# EAGLE design CarteMere_V1 (EAGLE 8.4.0)
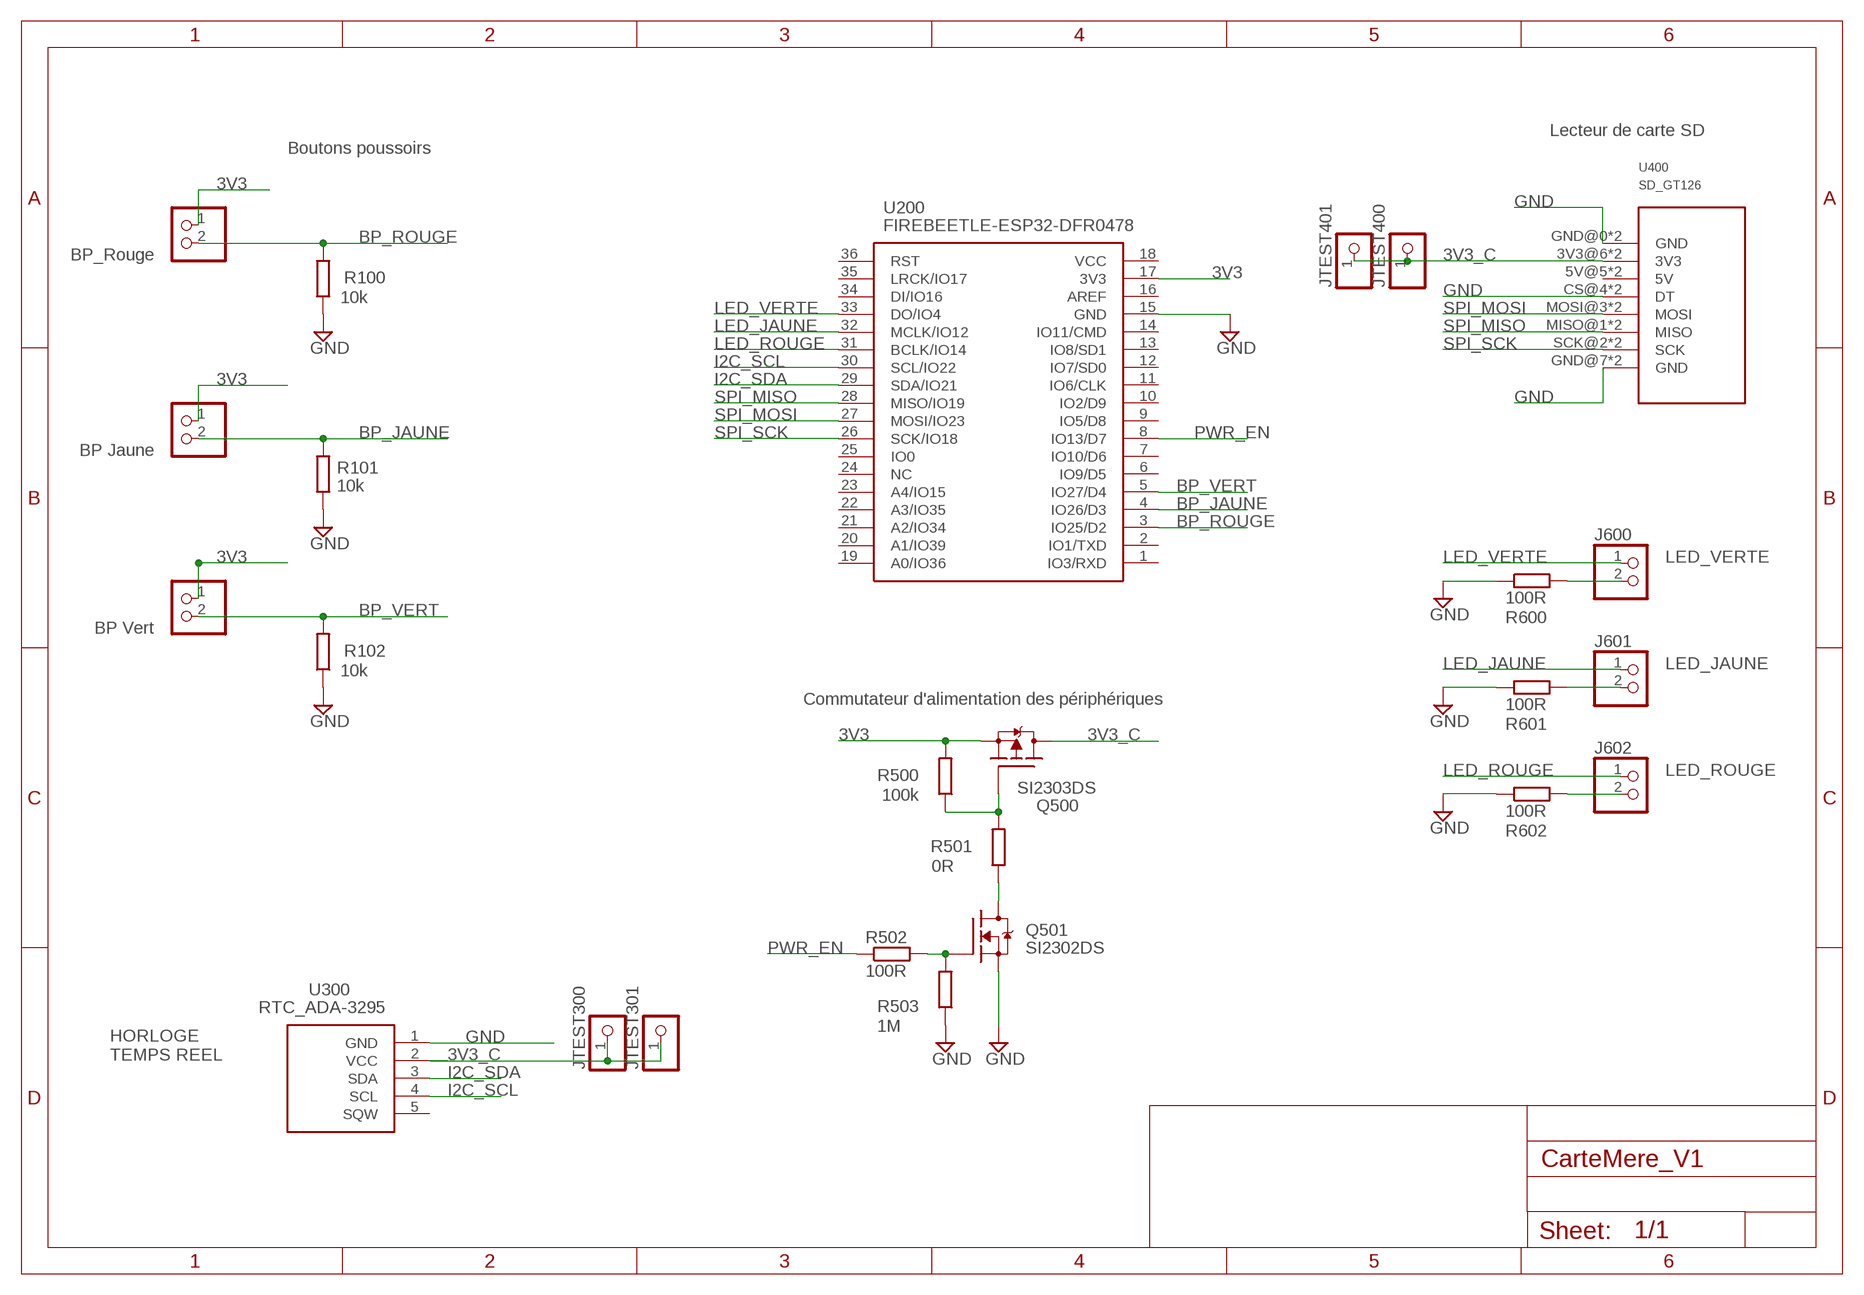
[diagram p0: schematic, sheet 1]
FRAME1 (A4L-LOC): SPICEPREFIX: X

## Parts
J100  BP_Rouge  PINHD-1X2  [1X02]
J101  BP Jaune  PINHD-1X2  [1X02]
J102  BP Vert  PINHD-1X2  [1X02]
J600  LED_VERTE  PINHD-1X2  [1X02]
J601  LED_JAUNE  PINHD-1X2  [1X02]
J602  LED_ROUGE  PINHD-1X2  [1X02]
JTEST300  PINHD-1X1  [1X01]
JTEST301  PINHD-1X1  [1X01]
JTEST400  PINHD-1X1  [1X01]
JTEST401  PINHD-1X1  [1X01]
Q500  SI2303DS  [SOT23]
Q501  SI2302DS  [SOT23]
R100  10k  R_1/4W10  [0207/10]
R101  10k  R_1/4W10  [0207/10]
R102  10k  R_1/4W10  [0207/10]
R500  100k  R_1/4W10  [0207/10]
R501  0R  R_1/4W10  [0207/10]
R502  100R  R_1/4W10  [0207/10]
R503  1M  R_1/4W10  [0207/10]
R600  100R  R_1/4W10  [0207/10]
R601  100R  R_1/4W10  [0207/10]
R602  100R  R_1/4W10  [0207/10]
U200  FIREBEETLE-ESP32-DFR0478  [FIREBEETLE_ESP32]
U300  RTC_ADA-3295  [ADA3295]
U400  SD_GT126  [SD_GT126]

## Nets
3V3: J100.1 J101.1 J102.1 Q500.2(S) R500.2 U200.17(3V3)
3V3_C: JTEST300.1 JTEST301.1 JTEST400.1 JTEST401.1 Q500.3(D) U300.2(VCC) U400.3V3@6(3V3) U400.3V3@9(3V3)
BP_JAUNE: J101.2 R101.2 U200.4(IO26/D3)
BP_ROUGE: J100.2 R100.2 U200.3(IO25/D2)
BP_VERT: J102.2 R102.2 U200.5(IO27/D4)
DQ501: Q501.3(D) R501.1
GND: Q501.2(S) R100.1 R101.1 R102.1 R503.1 R600.1 R601.1 R602.1 U200.15(GND) U300.1(GND) U400.CS@4(DT) U400.CS@11(DT) U400.GND@0(GND) U400.GND@7(GND) U400.GND@8(GND) U400.GND@15(GND)
I2C_SCL: U200.30(SCL/IO22) U300.4(SCL)
I2C_SDA: U200.29(SDA/IO21) U300.3(SDA)
LED_JAUNE: J601.1 U200.32(MCLK/IO12)
LED_ROUGE: J602.1 U200.31(BCLK/IO14)
LED_VERTE: J600.1 U200.33(DO/IO4)
N$1: Q501.1(G) R502.2 R503.2
N$2: J600.2 R600.2
N$3: J601.2 R601.2
N$4: J602.2 R602.2
N$7: Q500.1(G) R500.1 R501.2
PWR_EN: R502.1 U200.8(IO13/D7)
SPI_MISO: U200.28(MISO/IO19) U400.MISO@1(MISO) U400.MISO@14(MISO)
SPI_MOSI: U200.27(MOSI/IO23) U400.MOSI@3(MOSI) U400.MOSI@12(MOSI)
SPI_SCK: U200.26(SCK/IO18) U400.SCK@2(SCK) U400.SCK@13(SCK)
Unconnected: U200.1(IO3/RXD) U200.2(IO1/TXD) U200.6(IO9/D5) U200.7(IO10/D6) U200.9(IO5/D8) U200.10(IO2/D9) U200.11(IO6/CLK) U200.12(IO7/SD0) U200.13(IO8/SD1) U200.14(IO11/CMD) U200.16(AREF) U200.18(VCC) U200.19(A0/IO36) U200.20(A1/IO39) U200.21(A2/IO34) U200.22(A3/IO35) U200.23(A4/IO15) U200.24(NC) U200.25(IO0) U200.34(DI/IO16) U200.35(LRCK/IO17) U200.36(RST) U300.5(SQW) U400.5V@5(5V) U400.5V@10(5V)

## Notes on the sheet
- Lecteur de carte SD
- Boutons poussoirs
- Commutateur d'alimentation des périphériques
- HORLOGE
  TEMPS REEL

## Library data of the parts
J100-J102 J600-J602 = pinhead:PINHD-1X2: PIN HEADER
JTEST300 JTEST301 JTEST400 JTEST401 = pinhead:PINHD-1X1: PIN HEADER
Q500 = Eagle_UOF_Lib:SI2303DS: MOSFET Canal P
Q501 = Eagle_UOF_Lib:SI2302DS
R100-R102 R500-R503 R600-R602 = Eagle_UOF_Lib:R_1/4W
U200 = Eagle_UOF_Lib:FIREBEETLE-ESP32-DFR0478: Development Boards & Kits - Wireless FireBeetle ESP32 IOT MCU Source: Datasheet <https://github.com/Robert-MARKII/Document/blob/master/FireBeetle Board-ESP32 User Manual update.pdf>; DESCRIPTION: Development Boards & Kits - Wireless FireBeetle ESP32 IOT MCU; HEIGHT: mm; MANUFACTURER_NAME: DFRobot; MANUFACTURER_PART_NUMBER: DFR0478; MOUSER_PART_NUMBER: 426-DFR0478; MOUSER_PRICE-STOCK: https://www.mouser.co.uk/ProductDetail/DFRobot/DFR0478?qs=EU6FO9ffTwc%252BR65h2NUGQw%3D%3D
U300 = Eagle_UOF_Lib:RTC_ADA-3295: Real Time Clock module Source: Datasheet <https://learn.adafruit.com/adafruit-pcf8523-real-time-clock/downloads>; DESCRIPTION: Real Time Clock module; HEIGHT: 3.5mm; MANUFACTURER_NAME: Adafruit; MANUFACTURER_PART_NUMBER: ADA-3295
U400 = Eagle_UOF_Lib:SD_GT126

## Board
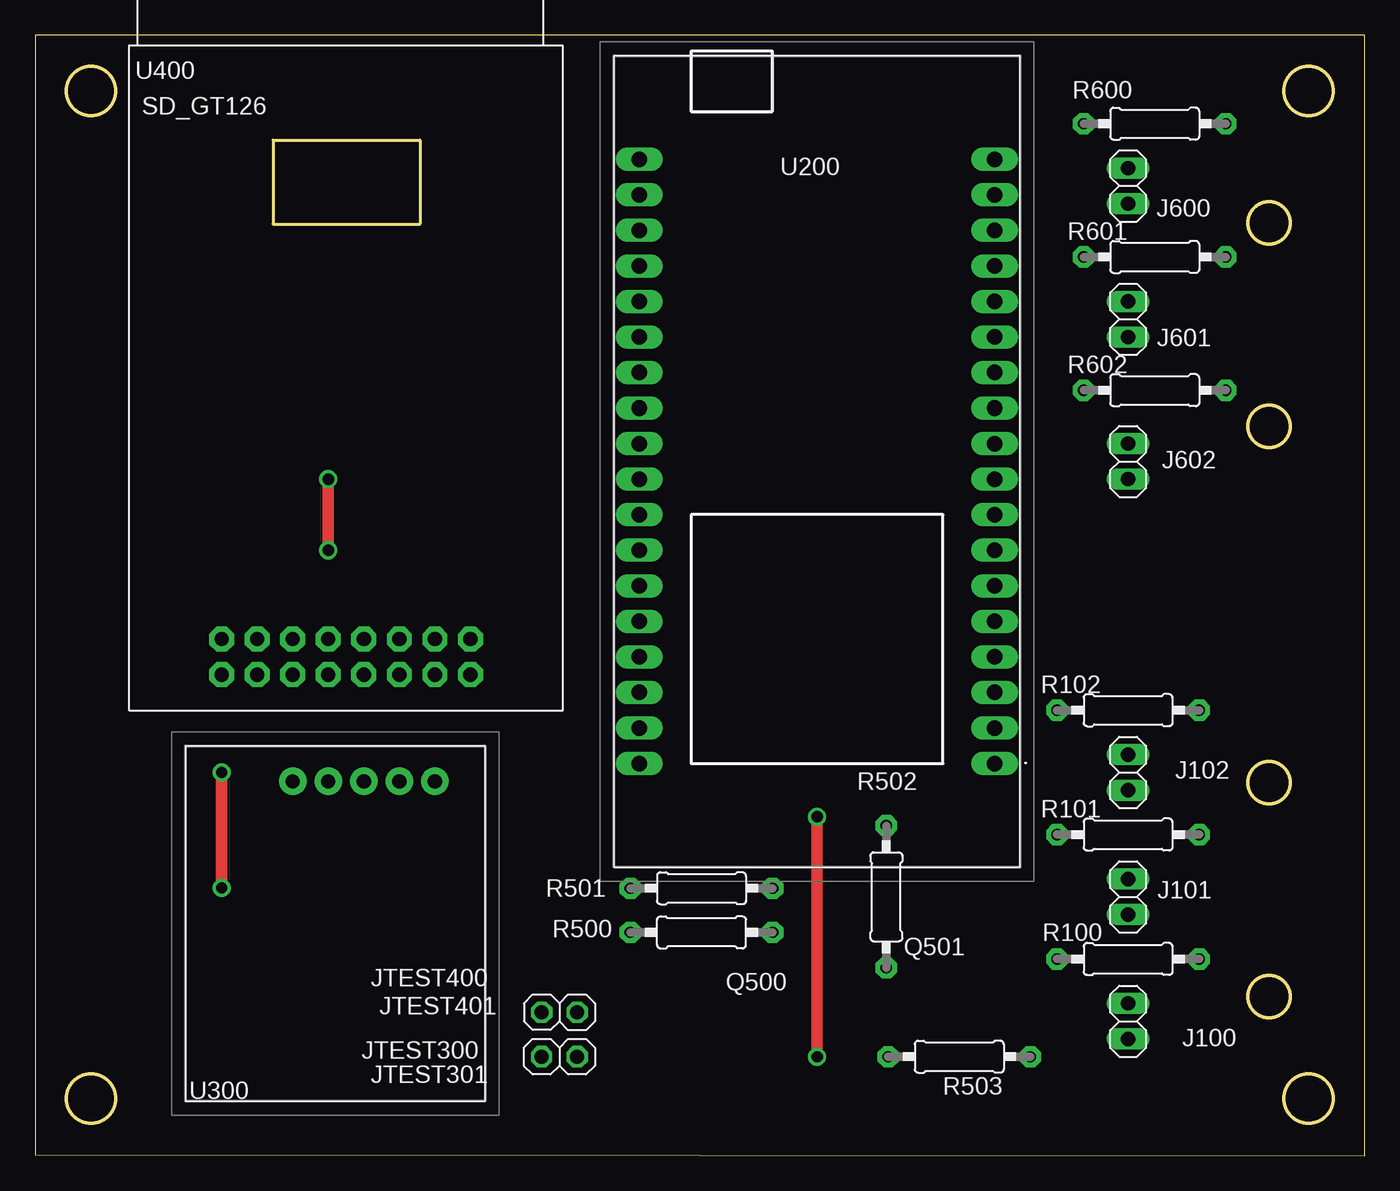
[diagram p1: board, top side]
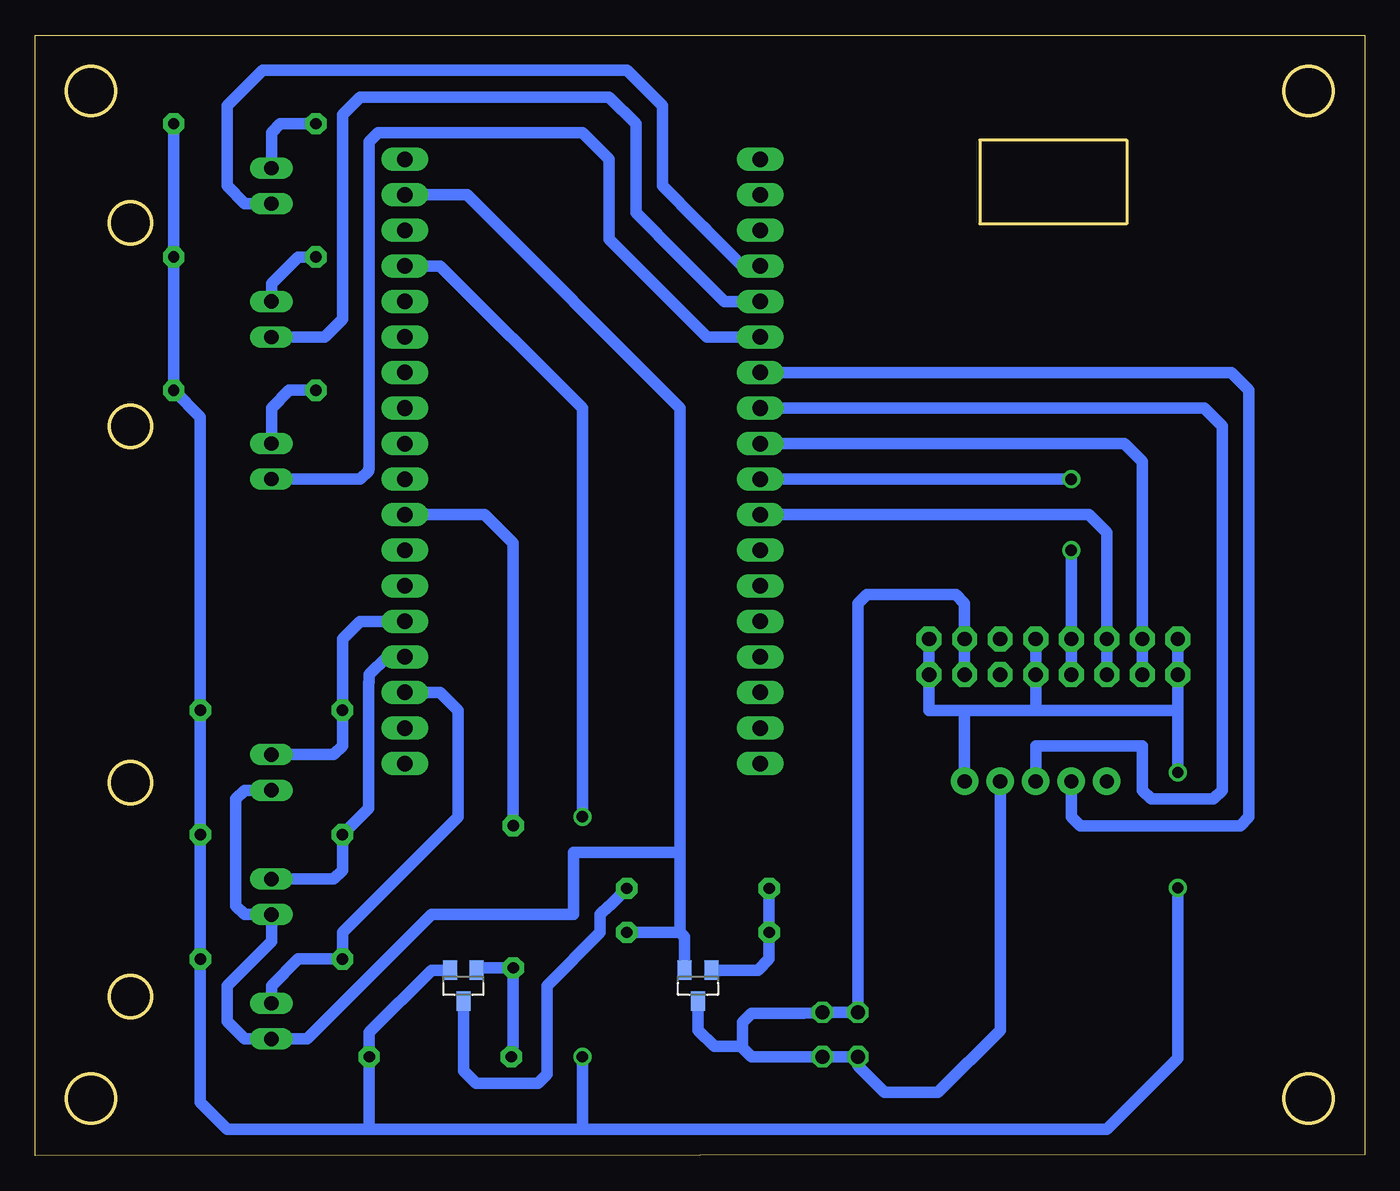
[diagram p2: board, bottom side, seen from below]

Size 95 x 80.08 mm. Coordinates in mm from the lower left corner, seen from the top.
Outline: 0,0.08 95,0 95,80.08 0,80.08 0,0.08
Outline: 17,72.58 27.5,72.58 27.5,66.58 17,66.58 17,72.58
Outline: circle at 4,76.08 radius 1.75
Outline: circle at 91,76.08 radius 1.75
Outline: circle at 91,4.08 radius 1.75
Outline: circle at 4,4.08 radius 1.75
Outline: circle at 88.19,66.65 radius 1.5
Outline: circle at 88.19,52.12 radius 1.5
Outline: circle at 88.19,26.65 radius 1.5
Outline: circle at 88.19,11.38 radius 1.5
Copper layers (1*16): Top 0.035mm / dielectric 1.5mm / Bottom 0.035mm
Design rules "default *": minimum track width 20mil, minimum drill 0.35mm, track to track 20mil, track to pad 20mil, pad to pad 20mil, via to via 20mil, smd to smd 6mil, copper to edge 20mil, drill to drill 20mil, minimum pad ring 10mil, minimum via ring 8mil, stop-mask expansion 4mil, vias tented up to drill 0mil, thermal gap 10mil

### Footprints (pad centres in the part's own frame; a part is rotated, then mirrored left to right if it is on the bottom)
1X02 = drill 1.016 long: 1 -1.27,0; 2 1.27,0
1X01 = drill 1.016 octagon: 1 0,0
SOT23 = smd 1 x 1.4: 1 -0.95,-1.1; 2 0.95,-1.1; 3 0,1.1
0207/10 = drill 0.813 pad 1.524 octagon: 1 -5.08,0; 2 5.08,0
FIREBEETLE_ESP32 = drill 1.11 pad 1.651 long: 1 25.4,12.7; 2 22.86,12.7; 18 -17.78,12.7 | drill 1.11 pad 1.665 long: 3 20.32,12.7; 4 17.78,12.7; 5 15.24,12.7; 6 12.7,12.7; 7 10.16,12.7; 8 7.62,12.7; 9 5.08,12.7; 10 2.54,12.7; 11 0,12.7; 12 -2.54,12.7; 13 -5.08,12.7; 14 -7.62,12.7; 15 -10.16,12.7; 16 -12.7,12.7; 17 -15.24,12.7; 19 25.4,-12.7; 20 22.86,-12.7; 21 20.32,-12.7; 22 17.78,-12.7; 23 15.24,-12.7; 24 12.7,-12.7; 25 10.16,-12.7; 26 7.62,-12.7; 27 5.08,-12.7; 28 2.54,-12.7; 29 0,-12.7; 30 -2.54,-12.7; 31 -5.08,-12.7; 32 -7.62,-12.7; 33 -10.16,-12.7; 34 -12.7,-12.7; 35 -15.24,-12.7; 36 -17.78,-12.7
ADA3295 = drill 1.016 pad 1.956: 1 0,0; 2 0,-2.54; 3 0,-5.08; 4 0,-7.62; 5 0,-10.16
SD_GT126 = drill 1.016 pad 1.778 octagon: 3V3@6 2.54,-6.35; 3V3@9 5.08,-6.35; 5V@5 2.54,-3.81; 5V@10 5.08,-3.81; CS@4 2.54,-1.27; CS@11 5.08,-1.27; GND@0 2.54,8.89; GND@7 2.54,-8.89; GND@8 5.08,-8.89; GND@15 5.08,8.89; MISO@1 2.54,6.35; MISO@14 5.08,6.35; MOSI@3 2.54,1.27; MOSI@12 5.08,1.27; SCK@2 2.54,3.81; SCK@13 5.08,3.81

### Placement (x,y rotation side)
J100  78.11,9.61 90 top
J101  78.11,18.49 90 top
J102  78.11,27.38 90 top
J600  78.11,69.3 90 top
J601  78.11,59.77 90 top
J602  78.11,49.61 90 top
JTEST300  36.2,7.07 0 top
JTEST301  38.74,7.07 0 top
JTEST400  36.2,10.25 0 top
JTEST401  38.74,10.24 0 top
Q500  47.62,12.14 180 bottom
Q501  64.39,12.14 180 bottom
R100  78.11,14.05 180 top
R101  78.11,22.94 180 top
R102  78.11,31.83 180 top
R500  47.62,15.96 0 top
R501  47.63,19.1 180 top
R502  60.83,18.49 270 top
R503  66.04,7.07 180 top
R600  80.01,73.74 180 top
R601  80.01,64.22 180 top
R602  80.01,54.69 180 top
U200  55.88,53.42 270 top
U300  28.57,26.75 270 top
U400  22.23,31.83 90 top

### Tracks (layer width: path | path; a pad name or v marks a point on that pad's centre or on a via)
3V3
  Bottom 0.813: 48.9,21.67 48.9,15.96 | 48.9,21.67 56.52,21.67 56.52,17.22 66.67,17.22 75.56,8.34 J100.1 80.01,8.34 81.28,9.61 81.28,12.14 78.11,15.32 J101.1 80.01,17.22 80.64,17.86 80.64,25.48 80.01,26.11 J102.1 | 48.9,21.67 48.9,53.42 64.14,68.66 U200.17 | 52.88,15.96 R500.2 48.9,15.96 | Q500.2 48.58,15.63 48.9,15.96
3V3_C
  Bottom 0.813: U400.3V3@6 U400.3V3@9 28.57,39.45 29.21,40.09 35.56,40.09 36.2,39.45 JTEST400.1 JTEST401.1 40.08,10.18 43.81,10.18 44.45,9.54 44.45,7.79 | Q500.3 47.62,8.97 46.45,7.79 44.45,7.79 | 44.45,7.79 44.45,7.7 43.81,7.07 JTEST301.1 JTEST300.1 36.2,6.43 34.29,4.53 30.48,4.53 26.04,8.97 U300.2
BP_JAUNE
  Bottom 0.813: J101.2 73.66,19.76 73.03,20.4 R101.2 71.16,24.81 71.16,33.82 71.12,33.86 71.12,34.37 69.85,35.64 U200.4
BP_ROUGE
  Bottom 0.813: J100.2 78.11,12.14 76.2,14.05 R100.2 73.03,15.96 64.77,24.21 64.77,31.83 66.04,33.1 U200.3
BP_VERT
  Bottom 0.813: J102.2 73.66,28.65 73.03,29.29 R102.2 73.03,36.91 71.75,38.18 U200.5
DQ501
  Bottom 0.813: Q501.3 64.39,6.05 63.5,5.16 59.05,5.16 58.42,5.79 58.42,12.14 54.61,15.96 54.61,17.22 53.98,17.86 53.95,17.83 R501.1
GND  (via drill 0.81 pad 1.3)
  Top 0.813: v13.34,27.38 v13.34,19.13 | v55.88,7.07 v55.88,24.21
  Bottom 0.813: U400.GND@15 U400.GND@0 13.34,31.83 | U400.GND@8 U400.GND@7 31.11,31.83 28.57,31.83 | U400.CS@11 U400.CS@4 23.5,31.83 | 28.57,31.83 23.5,31.83 | U300.1 28.57,31.83 | 13.34,31.83 23.5,31.83 | 13.34,31.83 v13.34,27.38 | 55.88,1.89 18.41,1.89 13.34,6.97 v13.34,19.13 | v55.88,7.07 55.88,1.89 | 71.12,1.89 55.88,1.89 | U200.15 66.04,63.58 55.88,53.42 v55.88,24.21 | 71.12,1.89 R503.1 71.12,8.8 66.67,13.24 Q501.2 | 71.12,1.89 81.28,1.89 83.19,3.79 R100.1 R101.1 R102.1 83.19,52.78 R602.1 R601.1 R600.1
I2C_SCL
  Bottom 0.813: U300.4 20.95,24.21 20.32,23.57 8.89,23.57 8.26,24.21 8.26,54.69 9.53,55.96 U200.30
I2C_SDA
  Bottom 0.813: U300.3 23.5,29.29 15.88,29.29 15.88,26.11 15.24,25.48 10.79,25.48 10.16,26.11 10.16,52.15 11.43,53.42 U200.29
LED_JAUNE
  Bottom 0.813: 48.9,64.22 48.26,63.58 | 48.9,64.22 52.07,67.39 52.07,73.74 53.98,75.64 71.75,75.64 73.03,74.38 73.03,59.77 74.3,58.5 J601.1 | U200.32 45.72,61.04 48.9,64.22
LED_ROUGE
  Bottom 0.813: J602.1 71.75,48.34 71.16,48.94 71.16,49.06 71.12,49.1 71.12,72.47 70.48,73.11 55.88,73.11 53.98,71.2 53.98,65.48 46.99,58.5 U200.31
LED_VERTE
  Bottom 0.813: 47.62,66.75 46.99,66.12 | 47.62,66.75 50.16,69.3 50.16,75.01 52.7,77.55 78.74,77.55 81.28,75.01 81.28,69.3 80.01,68.02 J600.1 | U200.33 44.45,63.58 47.62,66.75
N$1
  Bottom 0.813: Q501.1 63.27,13.42 R502.2 60.83,7.19 R503.2
N$2
  Bottom 0.813: J600.2 78.11,73.11 77.47,73.74 R600.2
N$3
  Bottom 0.813: R601.2 76.2,64.22 78.11,62.31 J601.2
N$4
  Bottom 0.813: 77.47,50.88 J602.2 78.11,53.42 76.83,54.69 R602.2
N$7
  Bottom 0.813: Q500.1 43.35,13.24 42.55,14.05 R500.1 R501.2
PWR_EN
  Bottom 0.813: U200.8 62.87,45.8 60.83,43.77 R502.1
SPI_MISO
  Bottom 0.813: U400.MISO@1 U400.MISO@14 15.88,49.61 17.14,50.88 U200.28
SPI_MOSI  (via drill 0.81 pad 1.3)
  Top 0.813: v20.95,43.26 v20.95,48.34
  Bottom 0.813: U400.MOSI@3 U400.MOSI@12 v20.95,43.26 | v20.95,48.34 U200.27
SPI_SCK
  Bottom 0.813: U400.SCK@2 U400.SCK@13 18.41,44.53 19.68,45.8 U200.26